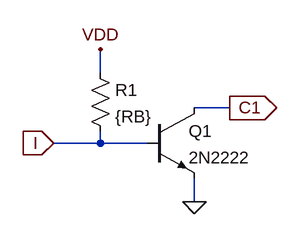
[diagram p0: schematic iilg1.asc]
iilg1.asc, the LTspice schematic file:
Version 4
SHEET 1 880 680
WIRE 384 240 384 208
WIRE 560 288 512 288
WIRE 384 336 384 320
WIRE 384 336 320 336
WIRE 448 336 384 336
WIRE 512 416 512 384
FLAG 512 416 0
FLAG 384 208 VDD
FLAG 320 336 I
IOPIN 320 336 In
FLAG 560 288 C1
IOPIN 560 288 Out
SYMBOL npn 448 288 R0
SYMATTR InstName Q1
SYMATTR Value 2N2222
SYMBOL res 368 224 R0
SYMATTR InstName R1
SYMATTR Value {RB}

The netlist it stands for:
* iilg1.asc
Q1 C1 I 0 0 2N2222
R1 VDD I {RB}
.model NPN NPN
.model PNP PNP
.lib standard.bjt
.backanno
.end